# Altium schematic sheet Diode - Schottky.SchDoc
size A3; SheetNumber: 24; SheetTotal: 40
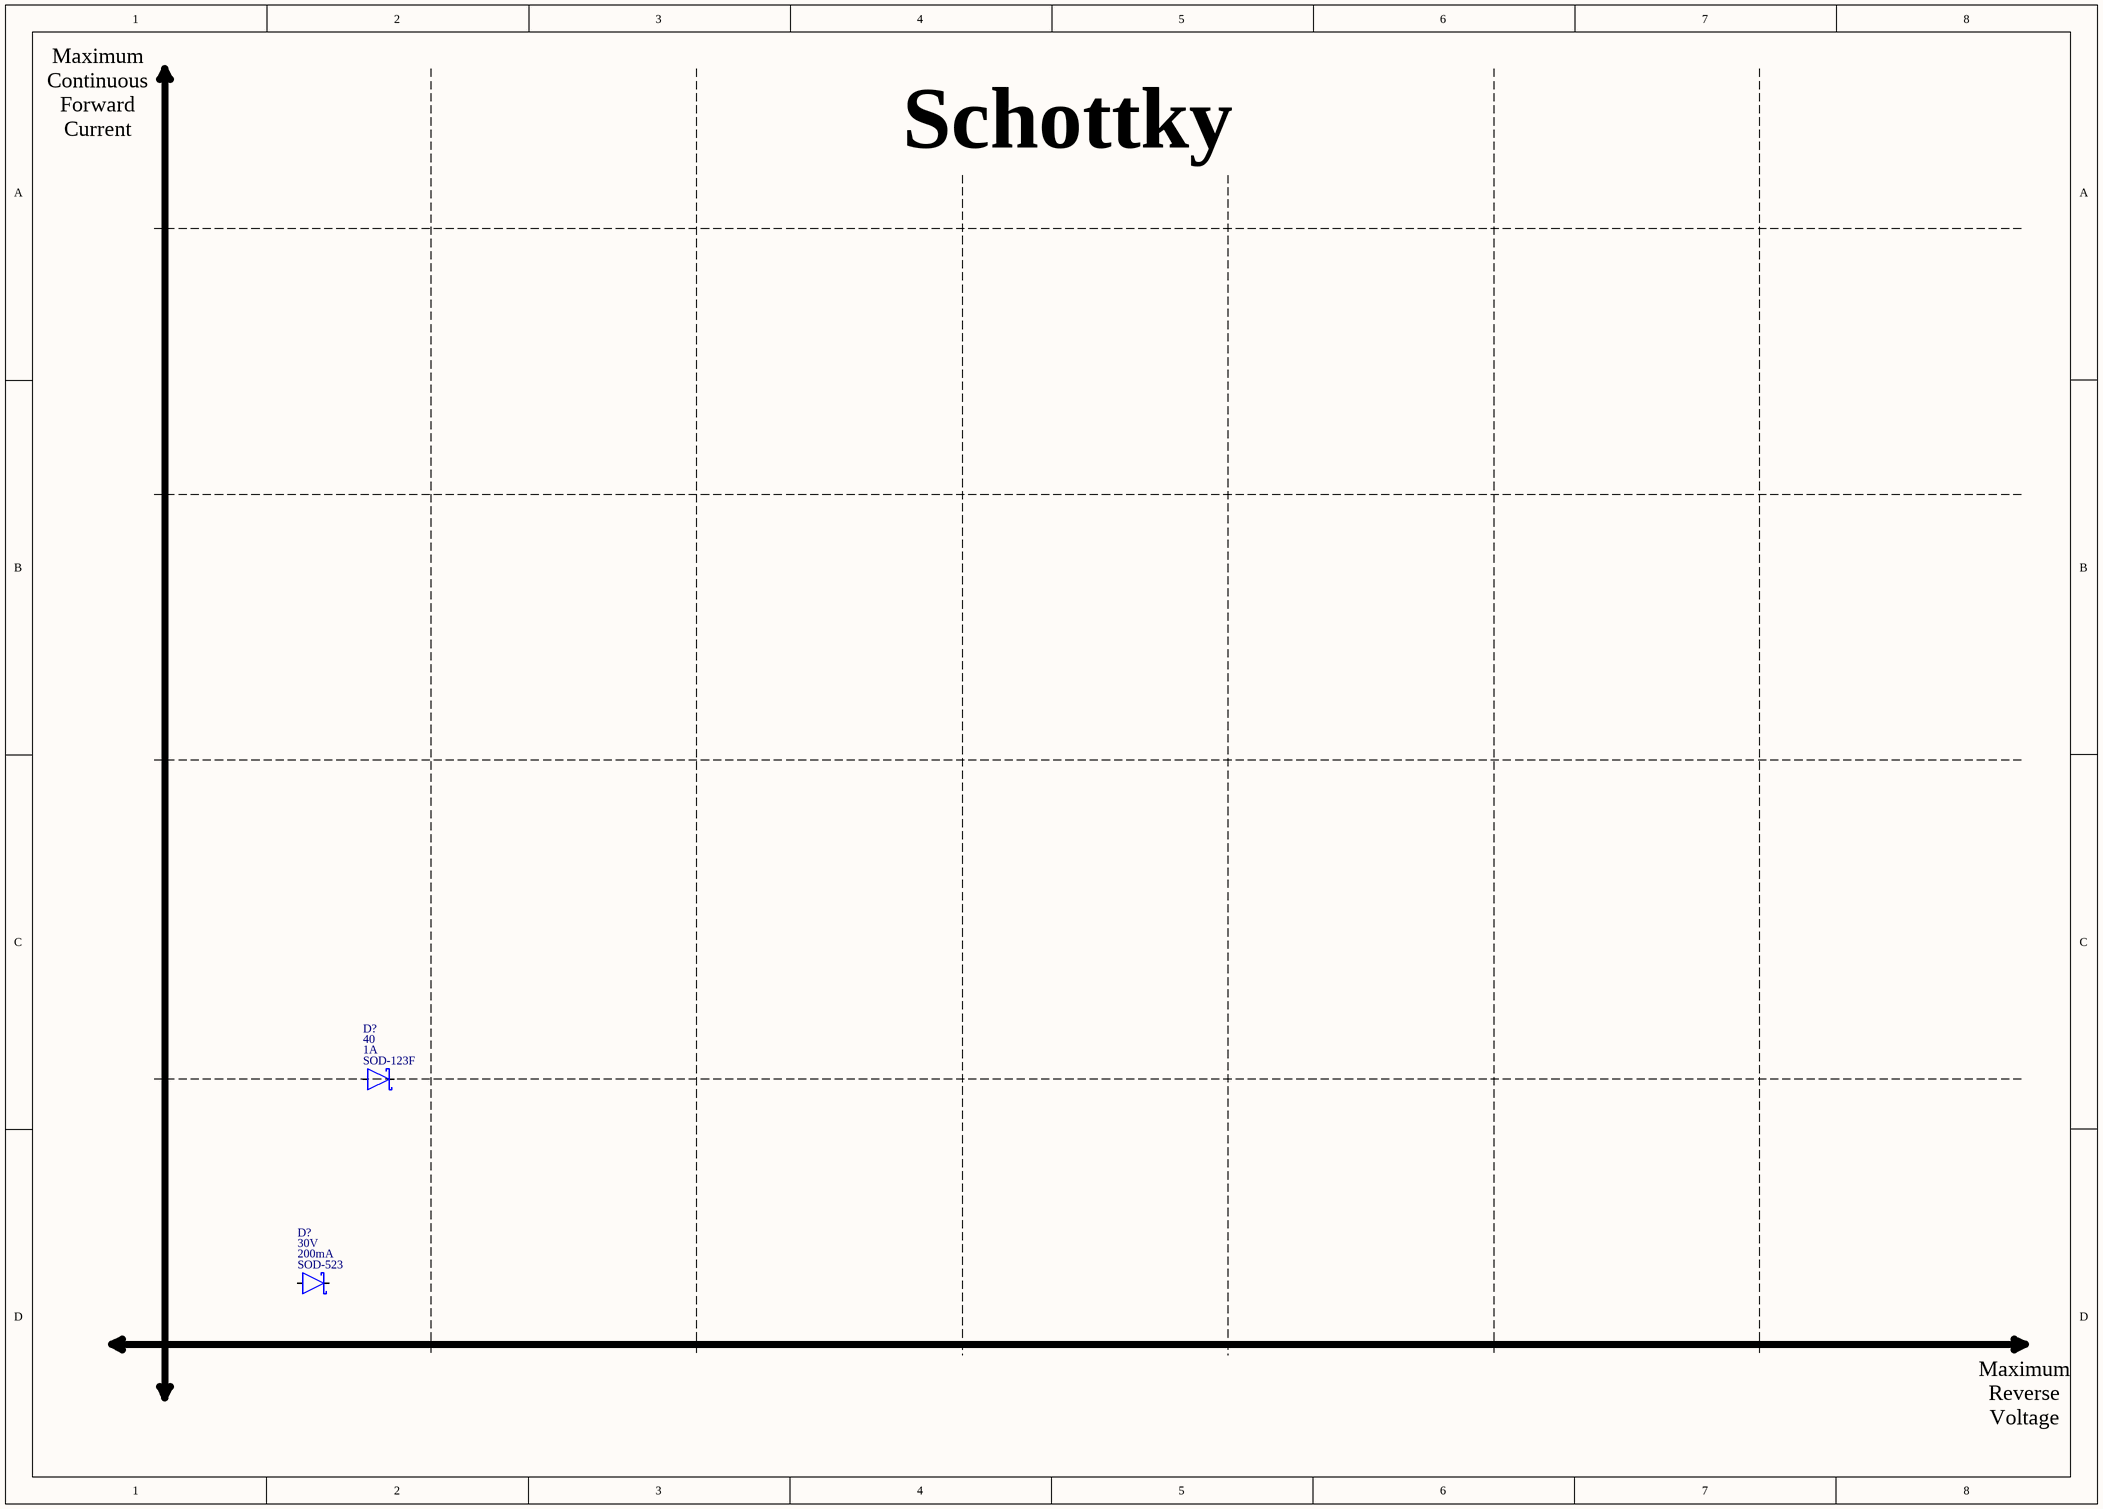
[diagram p0: Diode - Schottky.SchDoc]

## Parts
(Parts that share a designator on the sheet are numbered #1, #2 ... from top to bottom, then left to right.)
D?#1  Current: 1A  Voltage: 40  Package: SOD-123F  [Diode_SOD-123F]  (hidden comment: Diode_Schottky)
D?#2  Current: 200mA  Voltage: 30V  Package: SOD-523  [Diode_SOD-523_SC-79]  (hidden comment: Diode_Schottky)

## Nets

Not connected (* = marked no-connect by the designer): D?#1 A C; D?#2 A C

## Notes on the sheet
- Maximum
  Continuous
  Forward
  Current
- Schottky
- 1000A
- 100A
- 10A
- 1A
- 50V
- 100V
- 200V
- 400V
- 800V
- 1600V
- Maximum
  Reverse
  Voltage

## Library data of the parts
D?#1 = Diode_Schottky: Diode, Schottky, 40V, 1A, SOD-123F; Manufacturer Part Number: RB162MM-40TR; Manufacturer: Rohm; ComponentLink1Description: Datasheet; ComponentLink1URL: E:\Altium\Datasheets\Diode\Rohm, RB162MM-40.pdf; ComponentLink2Description: Supplier Link; ComponentLink2URL: https://www.digikey.com/en/products/detail/rohm-semiconductor/RB162MM-40TR/5001868; Supplier: Digikey; Supplier Part Number: RB162MM-40CT-ND; Operating Temperature, Min: ---℃; Operating Temperature, Max: +150℃; Quantity, Min: 1; Quantity, Max: 75000; Price, Min: 0.04; Price, Max: 0.0525; Supplier Currency: $; Supplier Link: https://www.digikey.com/en/products/detail/rohm-semiconductor/RB162MM-40TR/5001868; Component Type: Schottky; Component Category: Diode
D?#2 = Diode_Schottky: Diode, Schottky, 30V, 200mA, SOD-523; Manufacturer Part Number: CES521,L3F; Manufacturer: Toshiba; ComponentLink1Description: Datasheet; ComponentLink1URL: E:\Altium\Datasheets\Diode\Toshiba, CES521.pdf; ComponentLink2Description: Supplier Link; ComponentLink2URL: https://www.digikey.com/en/products/detail/toshiba-semiconductor-and-storage/CES521-L3F/3522356; Supplier: Digikey; Supplier Part Number: CES521L3FCT-ND; Operating Temperature, Min: ---℃; Operating Temperature, Max: +125℃; Quantity, Min: 1; Quantity, Max: 200000; Price, Min: 0.18; Price, Max: 0.018; Supplier Currency: $; Supplier Link: https://www.digikey.com/en/products/detail/toshiba-semiconductor-and-storage/CES521-L3F/3522356; Component Type: Schottky; Component Category: Diode